# EAGLE design piRoast_power (EAGLE 9.6.2)
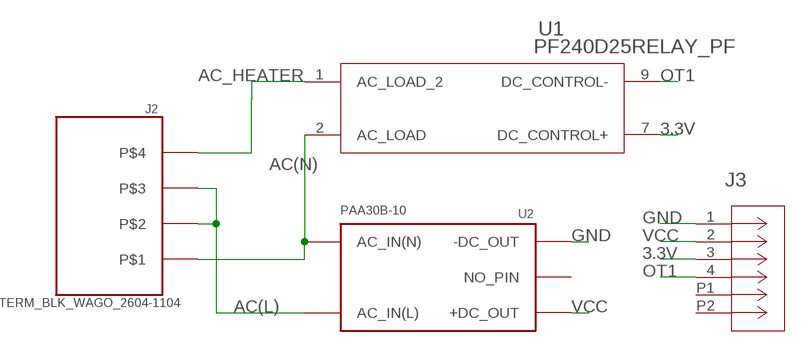
[diagram p0: schematic, sheet 1]

## Parts
J2  TERM_BLK_WAGO_2604-1104  [TERM_BLK_WAGO_2604-1104]
J3  436500414CON_436500414  [CON_436500414]
U1  PF240D25RELAY_PF  [RELAY_PF]
U2  PAA30B-10  [PAA30B-10]

## Nets
3.3V: J3.3 U1.7(DC_CONTROL+)
AC(L): J2.P1 J2.P2 J2.P5 J2.P6 U2.AC_IN(L)
AC(N): J2.P3 J2.P4 U1.2(AC_LOAD) U2.AC_IN(N)
AC_HEATER: J2.P0 J2.P7 U1.1(AC_LOAD_2)
GND: J3.1 U2.-DC_OUT
OT1: J3.4 U1.9(DC_CONTROL-)
VCC: J3.2 U2.+DC_OUT
Unconnected: J3.P1 J3.P2 U2.NO_PIN

## Library data of the parts
J2 = PCB_TERM_BLK_WAGO_2604-1104:TERM_BLK_WAGO_2604-1104
J3 = 436500414:436500414; COPYRIGHT: Copyright (C) 2024 Ultra Librarian. All rights reserved.; MANUFACTURER_PART_NUMBER: 436500414; MFR_NAME: Molex Connector Corporation
U1 = Crydom:PF240D25; COPYRIGHT: Copyright (C) 2023 Ultra Librarian. All rights reserved.; MANUFACTURER_PART_NUMBER: PF240D25; MFR_NAME: Sensata / Crydom
U2 = Power Supplies:PAA30B-10

## Board
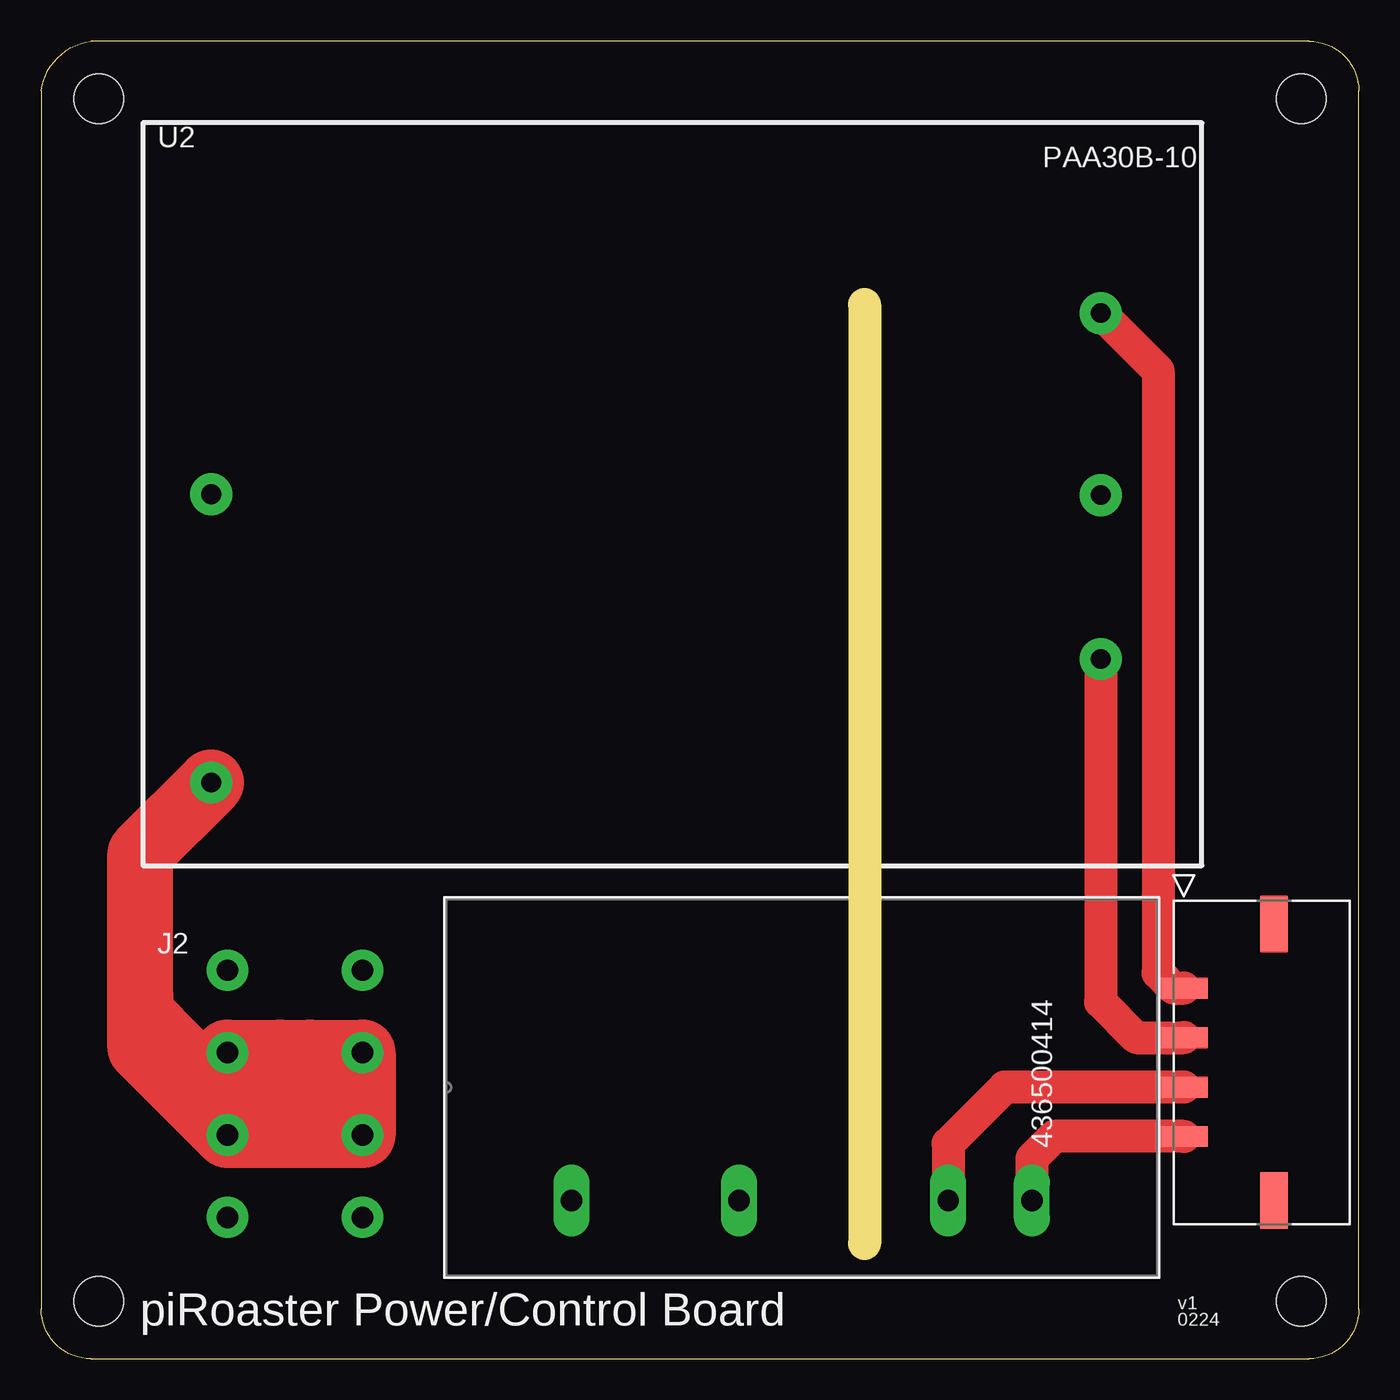
[diagram p1: board, top side]
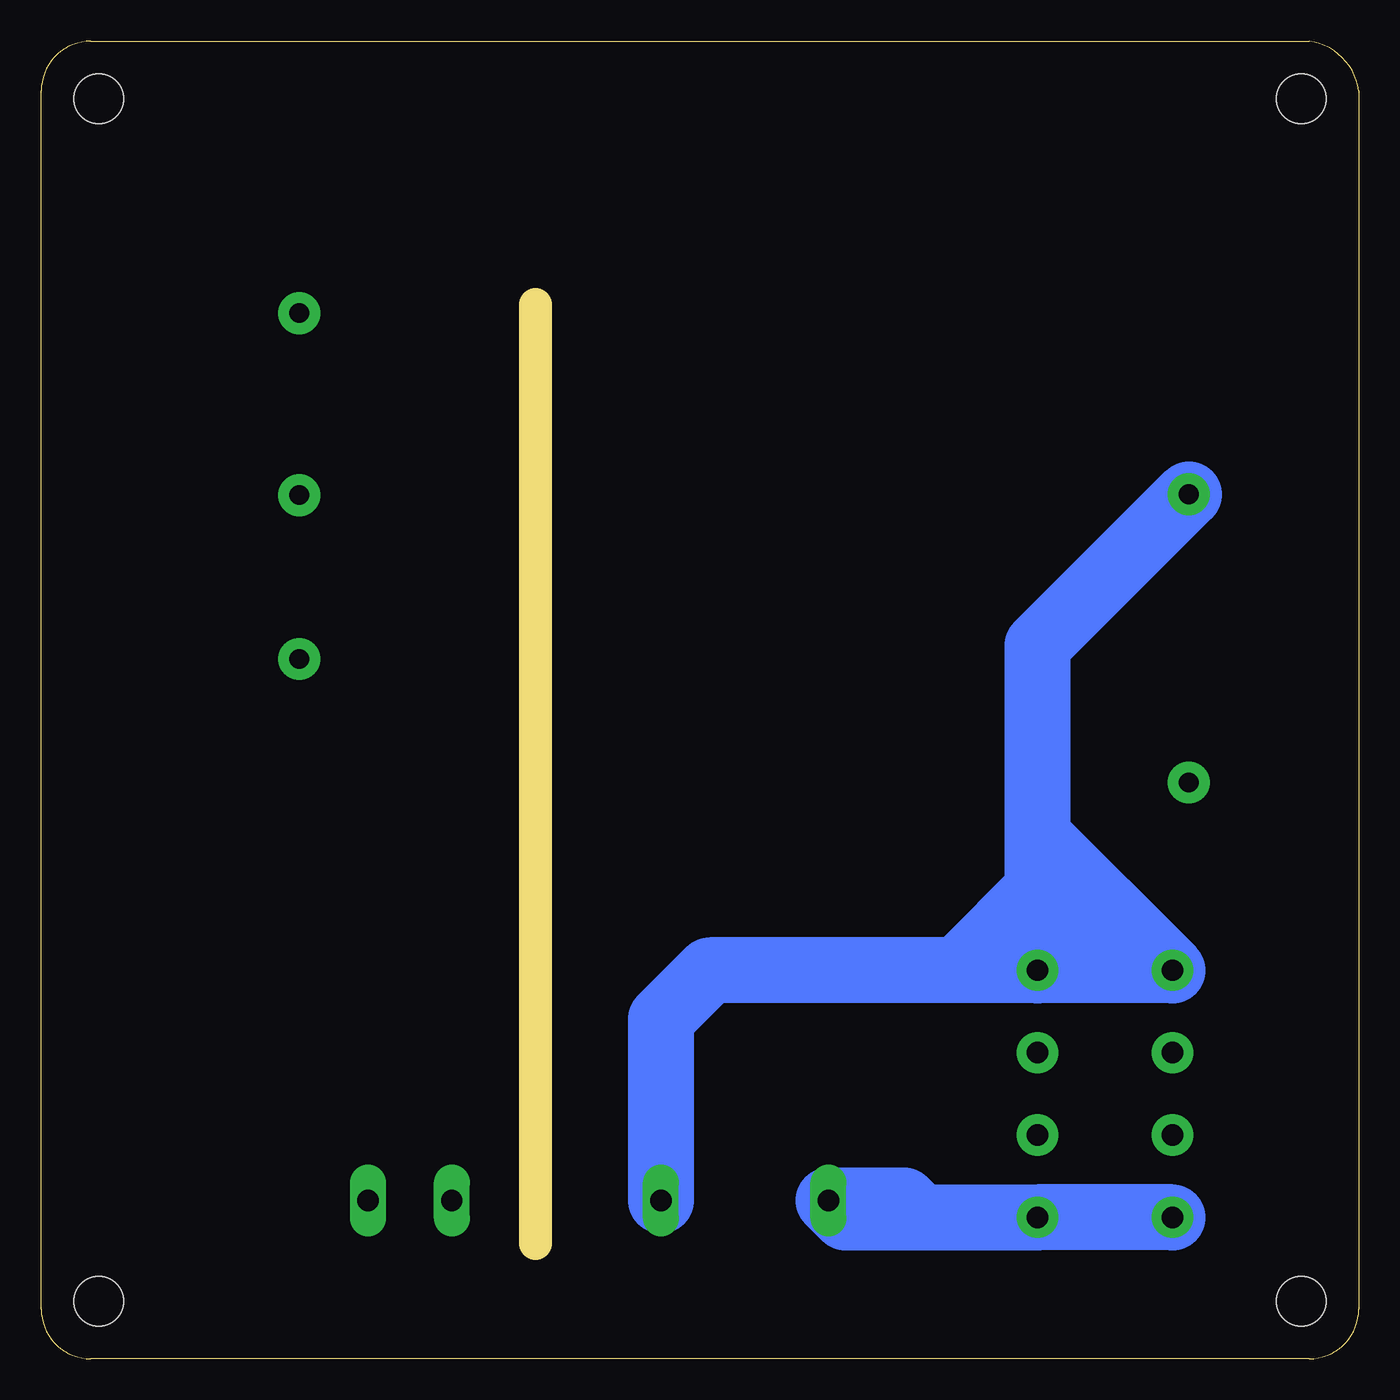
[diagram p2: board, bottom side, seen from below]

Size 80 x 80 mm. Coordinates in mm from the lower left corner, seen from the top.
Outline: 3,0 77,0 arc90 80,3 80,77 arc90 77,80 3,80 arc74 0,77 0,3 arc90 3,0
Copper layers (1*16): Top 0.035mm / dielectric 1.5mm / Bottom 0.035mm
Design rules "default": minimum track width 6mil, minimum drill 0.35mm, track to track 6mil, track to pad 6mil, pad to pad 6mil, via to via 6mil, smd to smd 6mil, copper to edge 40mil, drill to drill 6mil, minimum pad ring 10mil, minimum via ring 8mil, stop-mask expansion 4mil, vias tented up to drill 0mil, thermal gap 10mil
Holes 3 mm at 3.5,3.5 3.5,76.5 76.5,3.5 76.5,76.5
Milling: 1 lines

### Footprints (pad centres in the part's own frame; a part is rotated, then mirrored left to right if it is on the bottom)
TERM_BLK_WAGO_2604-1104 = drill 1.3 pad 2.5: P0 15,0; P1 10,0; P2 5,0; P3 0,0; P4 0,-8.2; P5 5,-8.2; P6 10,-8.2; P7 15,-8.2
CON_436500414 = smd 1.27 x 2.92: 1 4.5,5.12; 2 1.5,5.12; 3 -1.5,5.12; 4 -4.5,5.12 | smd 3.43 x 1.65: P1 8.385,-0.35; P2 -8.385,-0.35
RELAY_PF = drill 1.3 pad 2.184 long: 1 0,0; 2 0,-10.16; 7 0,-22.86; 9 0,-27.94
PAA30B-10 = drill 1.2 pad 2.54: +DC_OUT 58.15,12.55; -DC_OUT 58.15,33.55; AC_IN(L) 4.15,5.05; AC_IN(N) 4.15,22.55; NO_PIN 58.15,22.5

### Placement (x,y rotation side)
J2  19.51,23.59 270 top
J3  74.5,18 90 top
U1  32.21,9.62 90 top
U2  6.17,29.94 0 top

### Tracks (layer width: path | path; a pad name or v marks a point on that pad's centre or on a via)
3.3V
  Top 2: U1.7 55.07,13.07 58.5,16.5 J3.3
AC(L)
  Top 2.54: J2.P5 9.43,18.59 6.02,22
  Top 4: J2.P6 J2.P1 | J2.P5 J2.P2 | J2.P5 14.51,18.59 J2.P1 | J2.P6 16.31,18.59 J2.P2 | J2.P6 J2.P5 | J2.P2 J2.P1 | U2.AC_IN(L) 6.02,30.68 6.02,22 6.02,18.88 J2.P6
AC(N)
  Bottom 4: J2.P4 J2.P3 | J2.P3 39.41,23.59 42.37,20.63 U1.2 | J2.P3 19.51,28.49 | U2.AC_IN(N) 19.51,43.3 19.51,31.79 | J2.P4 19.51,31.79 | J2.P4 14.72,27 18,27 | 19.51,31.79 19.51,28.49 | 19.51,28.49 24,24
AC_HEATER
  Bottom 4: J2.P7 J2.P0 31.18,8.59 U1.1 27.62,9.62 27,9
GND
  Top 2: U2.-DC_OUT 67.81,60.01 67.81,23.43 68.74,22.5 J3.1
OT1
  Top 2: U1.9 60.15,12.15 61.5,13.5 J3.4
VCC
  Top 2: U2.+DC_OUT 64.33,21.68 66.5,19.5 J3.2

### Text on the board
tPlace: piRoaster Power/Control Board | v1 / 0224